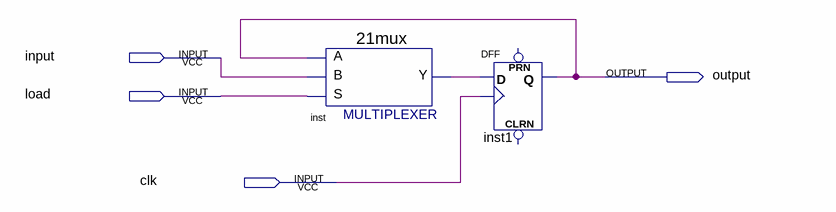
[diagram p0: schematic sheet]
// Quartus schematic B0729047_lab03_1.bdf as structural Verilog: 2 symbols, 4 pins
module B0729047_lab03_1 (
  input  \input ,
  input  load,
  input  clk,
  output \output 
);

  wire inst_y;

  \21mux  inst (.S(load), .B(\input ), .A(\output ), .Y(inst_y));
  DFF inst1 (.CLK(clk), .D(inst_y), .Q(\output ));  // open: CLRN, PRN
endmodule
